# EAGLE design PIZ-Dual v886 (EAGLE 7.6.0)
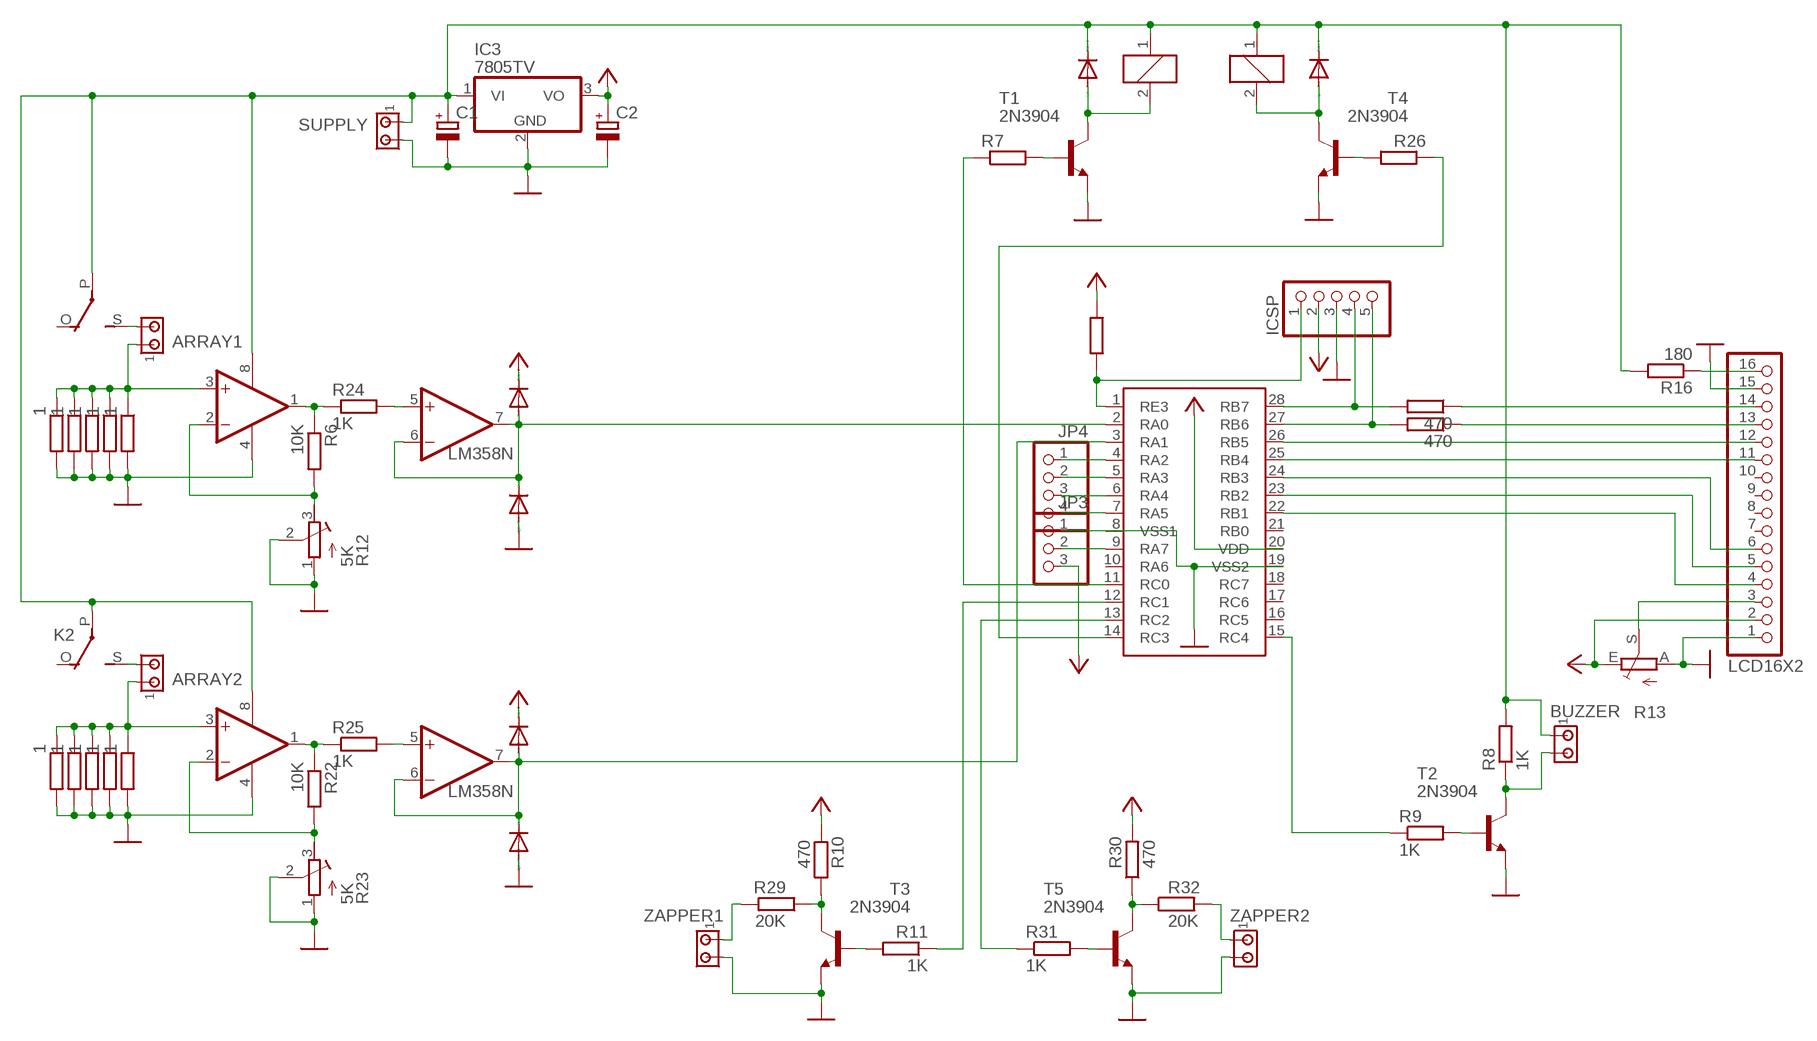
[diagram p0: schematic, sheet 1]

## Parts
ARRAY1  MTA02-100  [10X02MTA]
ARRAY2  MTA02-100  [10X02MTA]
BUZZER  MTA02-100  [10X02MTA]
C1  CPOL-EUE2.5-7  [E2,5-7]
C2  CPOL-EUE2.5-7  [E2,5-7]
D1  1N4148DO35-7  [DO35-7]
D2  1N4148DO35-7  [DO35-7]
D3  1N4148DO35-7  [DO35-7]
D4  1N4148DO35-7  [DO35-7]
D5  1N4148DO35-7  [DO35-7]
D6  1N4148DO35-7  [DO35-7]
IC2  LM358N  [DIL08]
IC3  7805TV  [TO220V]
IC4  LM358N  [DIL08]
ICSP  PINHD-1X55X2MM  [1_05X2MM]
JP3  PINHD-1X3  [1X03]
JP4  PINHD-1X4  [1X04]
K1  G5L  [G5LE]
K2  G5L  [G5LE]
LCD16X2  PINHD-1X16  [1X16]
R1  1  R-EU_0204/7  [0204/7]
R2  1  R-EU_0204/7  [0204/7]
R3  1  R-EU_0204/7  [0204/7]
R4  1  R-EU_0204/7  [0204/7]
R5  1  R-EU_0204/7  [0204/7]
R6  10K  R-EU_0204/7  [0204/7]
R7  R-EU_0204/7  [0204/7]
R8  1K  R-EU_0204/7  [0204/7]
R9  1K  R-EU_0204/7  [0204/7]
R10  470  R-EU_0204/7  [0204/7]
R11  1K  R-EU_0204/7  [0204/7]
R12  5K  R-TRIMM64W  [RTRIM64W]
R13  TRIM_EU-CA6V  [CA6V]
R16  180  R-EU_0309/10  [0309/10]
R17  1  R-EU_0204/7  [0204/7]
R18  1  R-EU_0204/7  [0204/7]
R19  1  R-EU_0204/7  [0204/7]
R20  1  R-EU_0204/7  [0204/7]
R21  1  R-EU_0204/7  [0204/7]
R22  10K  R-EU_0204/7  [0204/7]
R23  5K  R-TRIMM64W  [RTRIM64W]
R24  1K  R-EU_0204/7  [0204/7]
R25  1K  R-EU_0204/7  [0204/7]
R26  R-EU_0204/7  [0204/7]
R27  470  R-EU_0204/7  [0204/7]
R28  470  R-EU_0204/7  [0204/7]
R29  20K  R-EU_0204/7  [0204/7]
R30  470  R-EU_0204/7  [0204/7]
R31  1K  R-EU_0204/7  [0204/7]
R32  20K  R-EU_0204/7  [0204/7]
R33  10K  R-EU_0204/7  [0204/7]
SUPPLY  MTA02-100  [10X02MTA]
T1  2N3904  [TO92]
T2  2N3904  [TO92]
T3  2N3904  [TO92]
T4  2N3904  [TO92]
T5  2N3904  [TO92]
U$1  PIC16F88  [SO28W]
ZAPPER1  MTA02-100  [10X02MTA]
ZAPPER2  MTA02-100  [10X02MTA]

## Nets
E: R11.1 U$1.12(RC1)
GND: C1.- C2.- D2.A D5.A IC2.4(P:V-) IC3.2(GND) IC4.4(P:V-) ICSP.3 JP3.1 LCD16X2.1 LCD16X2.15 R1.2 R2.2 R3.2 R4.2 R5.2 R12.1(A) R12.2(S) R13.A R17.2 R18.2 R19.2 R20.2 R21.2 R23.1(A) R23.2(S) SUPPLY.2 T1.3(E) T2.3(E) T3.3(E) T4.3(E) T5.3(E) U$1.8(VSS1) U$1.19(VSS2) ZAPPER1.2 ZAPPER2.2
N$1: ARRAY1.1 IC2.3(A:+IN) R1.1 R2.1 R3.1 R4.1 R5.1
N$2: ARRAY1.2 K1.S(2:S)
N$3: IC2.1(A:OUT) R6.1 R24.1
N$4: IC2.2(A:-IN) R6.2 R12.3(E)
N$5: BUZZER.2 R8.1 T2.1(C)
N$6: D1.A D2.C IC2.6(B:-IN) IC2.7(B:OUT) U$1.2(RA0)
N$7: D3.A K1.2 T1.1(C)
N$8: R29.2 ZAPPER1.1
N$9: R7.2 T1.2(B)
N$10: R9.2 T2.2(B)
N$11: R11.2 T3.2(B)
N$12: R9.1 U$1.15(RC4)
N$13: LCD16X2.4 U$1.22(RB1)
N$14: R7.1 U$1.11(RC0)
N$15: LCD16X2.14 R27.1
N$16: LCD16X2.13 R28.1
N$17: LCD16X2.12 U$1.26(RB5)
N$18: LCD16X2.11 U$1.25(RB4)
N$19: ARRAY2.1 IC4.3(A:+IN) R17.1 R18.1 R19.1 R20.1 R21.1
N$21: LCD16X2.6 U$1.24(RB3)
N$22: LCD16X2.3 R13.S
N$23: LCD16X2.5 U$1.23(RB2)
N$24: BUZZER.1 C1.+ D3.C D6.C IC2.8(P:V+) IC3.1(VI) IC4.8(P:V+) K1.1 K1.P(2:P) K2.1 K2.P(2:P) R8.2 R16.2 SUPPLY.1
N$25: LCD16X2.16 R16.1
N$26: ICSP.5 R28.2 U$1.27(RB6)
N$27: ICSP.4 R27.2 U$1.28(RB7)
N$28: IC4.1(A:OUT) R22.1 R25.1
N$29: IC4.2(A:-IN) R22.2 R23.3(E)
N$30: D4.A D5.C IC4.6(B:-IN) IC4.7(B:OUT) U$1.3(RA1)
N$31: ARRAY2.2 K2.S(2:S)
N$32: IC2.5(B:+IN) R24.2
N$33: IC4.5(B:+IN) R25.2
N$35: D6.A K2.2 T4.1(C)
N$36: R26.2 T4.2(B)
N$37: R26.1 U$1.14(RC3)
N$38: R31.1 U$1.13(RC2)
N$39: R10.1 R29.1 T3.1(C)
N$40: R31.2 T5.2(B)
N$41: R32.2 ZAPPER2.1
N$42: JP4.1 U$1.4(RA2)
N$43: R30.1 R32.1 T5.1(C)
N$44: ICSP.1 R33.2 U$1.1(RE3)
N$46: JP4.2 U$1.5(RA3)
N$49: JP4.3 U$1.6(RA4)
N$50: JP4.4 U$1.7(RA5)
N$51: JP3.2 U$1.9(RA7)
VCC: C2.+ D1.C D4.C IC3.3(VO) ICSP.2 JP3.3 LCD16X2.2 R10.2 R13.E R30.2 R33.1 U$1.20(VDD)
Unconnected: K1.O(2:O) K2.O(2:O) LCD16X2.7 LCD16X2.8 LCD16X2.9 LCD16X2.10 U$1.10(RA6) U$1.16(RC5) U$1.17(RC6) U$1.18(RC7) U$1.21(RB0)

## Library data of the parts
ARRAY1 ARRAY2 BUZZER SUPPLY ZAPPER1 ZAPPER2 = con-amp:MTA02-100: AMP connector
C1 C2 = rcl:CPOL-EU: POLARIZED CAPACITOR, European symbol
D1-D6 = diode:1N4148: DIODE high speed (Philips)
IC2 IC4 = linear:LM358: OP AMP also LM158; LM258; LM2904 Source: http://cache.national.com/ds/LM/LM158.pdf
IC3 = linear:78*: Positive VOLTAGE REGULATOR Source: http://cache.national.com/ds/LM/LM78L05.pdf http://www.fairchildsemi.com/ds/LM/LM7805.pdf
ICSP = pinhead:PINHD-1X5: PIN HEADER
JP3 = pinhead:PINHD-1X3: PIN HEADER
JP4 = pinhead:PINHD-1X4: PIN HEADER
K1 K2 = relay:G5L: RELAY 1 x switch, 10 A/120 V AC, 8 A/30 V ADC, Omron; OC_FARNELL: unknown; OC_NEWARK: unknown
LCD16X2 = pinhead:PINHD-1X16: PIN HEADER
R1-R11 R16-R22 R24-R33 = rcl:R-EU_: RESISTOR, European symbol
R12 R23 = rcl:R-TRIMM: Trimm resistor
R13 = pot:TRIM_EU-: POTENTIOMETER
T1-T5 = transistor:2N3904: NPN TRANSISTOR
U$1 = microchip:PIC16F88*: PIC16F886 - Hecho por Cesar Gil Lao

## Board
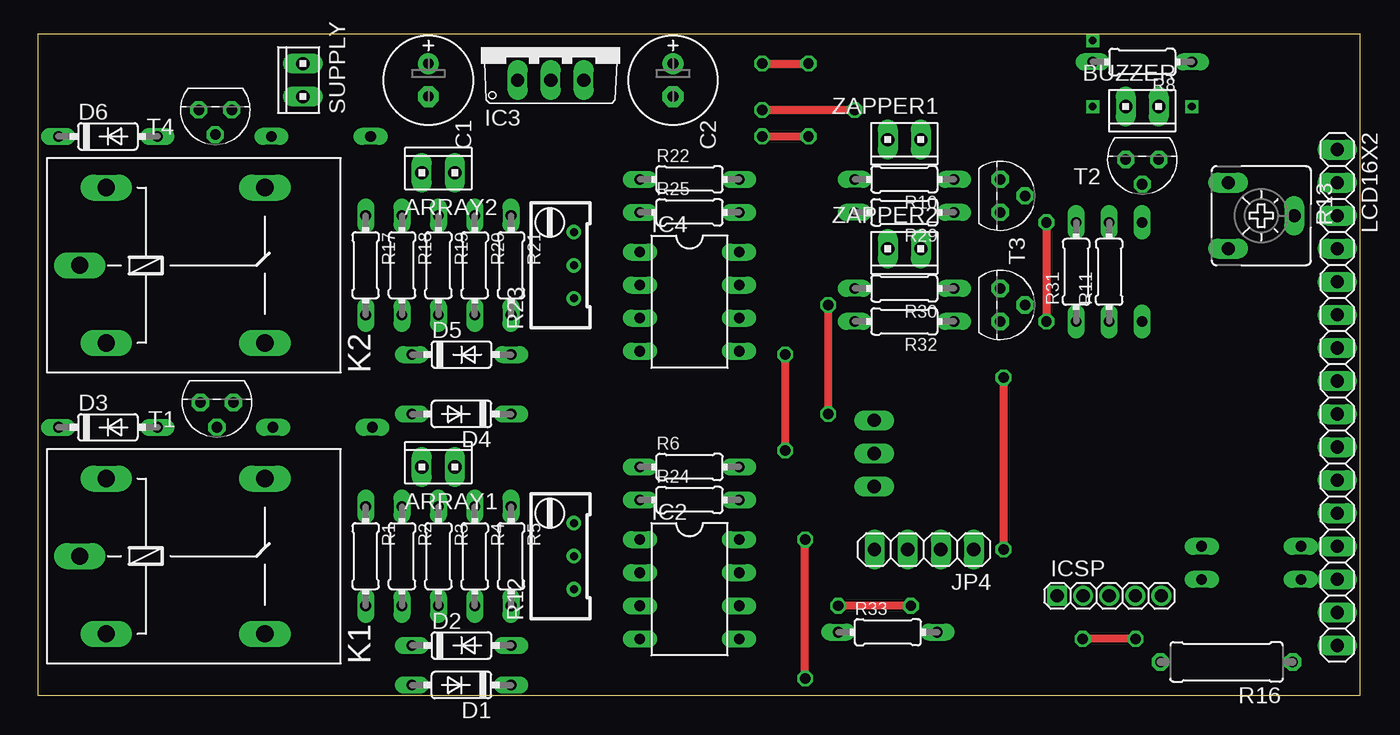
[diagram p1: board, top side]
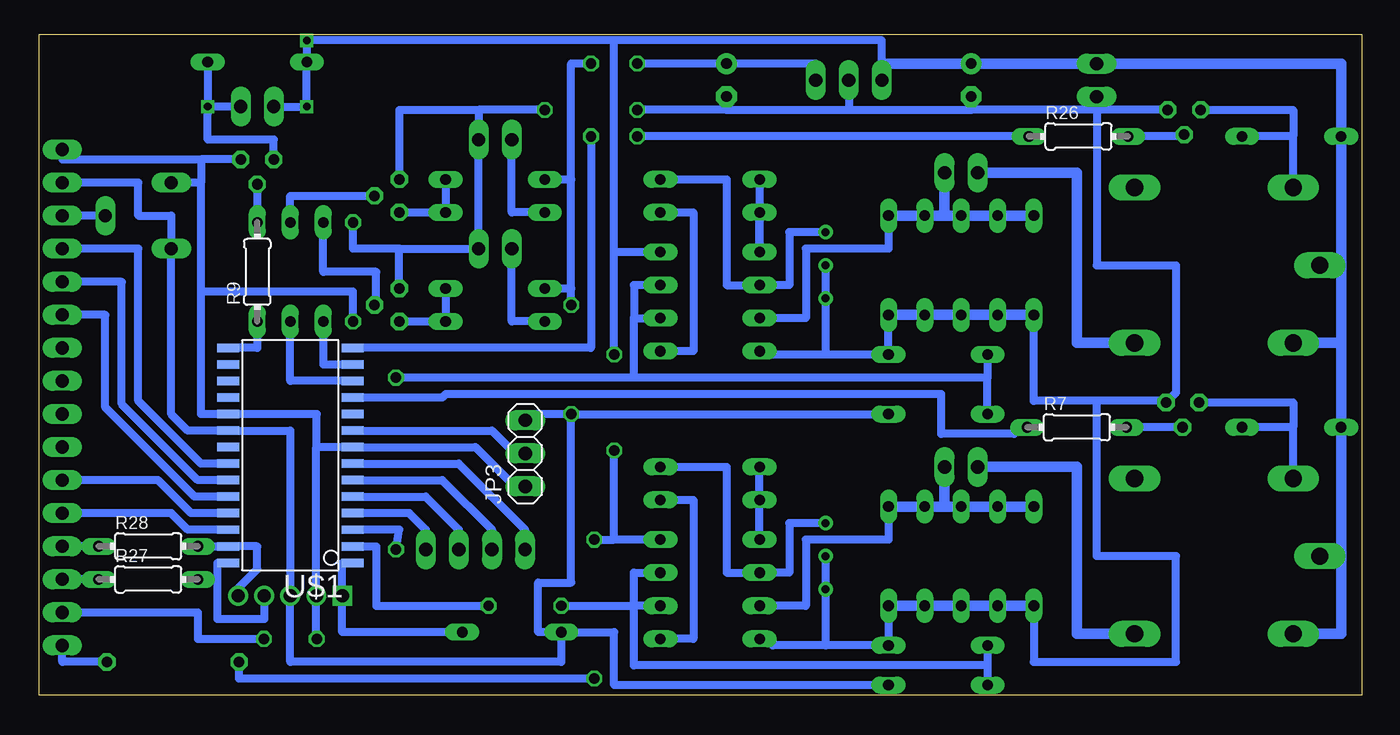
[diagram p2: board, bottom side, seen from below]

Size 101.65 x 50.78 mm. Coordinates in mm from the lower left corner, seen from the top.
Outline: 101.65,0 101.65,50.78 0,50.78 0,0 101.65,0
Copper layers (1*16): Top 0.035mm / dielectric 1.5mm / Bottom 0.035mm
Design rules "default": minimum track width 10mil, minimum drill 24mil, track to track 8mil, track to pad 8mil, pad to pad 8mil, via to via 8mil, smd to smd 8mil, copper to edge 40mil, drill to drill 8mil, minimum pad ring 10mil, minimum via ring 8mil, stop-mask expansion 4mil, vias tented up to drill 0mil, thermal gap 10mil

### Footprints (pad centres in the part's own frame; a part is rotated, then mirrored left to right if it is on the bottom)
10X02MTA = drill 1.016 long: 1 1.27,0; 2 -1.27,0
E2,5-7 = drill 0.813 pad 1.6: + -1.27,0 | drill 0.813 pad 1.6 octagon: - 1.27,0
DO35-7 = drill 0.813 long: A 3.81,0; C -3.81,0
DIL08 = drill 0.813 pad 1.27 long: 1 -3.81,-3.81; 2 -1.27,-3.81; 3 1.27,-3.81; 4 3.81,-3.81; 5 3.81,3.81; 6 1.27,3.81; 7 -1.27,3.81; 8 -3.81,3.81
TO220V = drill 1.016 long: 1 -2.54,-2.54; 2 0,-2.54; 3 2.54,-2.54
1_05X2MM = drill 1.016 pad 1.3 square: 1 -4,0 | drill 1.016 pad 1.3: 2 0,0; 3 -2,0; 4 2,0; 5 4,0
1X03 = drill 1.016 long: 1 -2.54,0; 2 0,0; 3 2.54,0
1X04 = drill 1.016 long: 1 -3.81,0; 2 -1.27,0; 3 1.27,0; 4 3.81,0
G5LE = drill 1.321 long: 1 -7.493,-5.969; 2 -7.493,5.969; O 4.699,5.969; P -9.525,0; S 4.699,-5.969
1X16 = drill 1.016 long: 1 -19.05,0; 2 -16.51,0; 3 -13.97,0; 4 -11.43,0; 5 -8.89,0; 6 -6.35,0; 7 -3.81,0; 8 -1.27,0; 9 1.27,0; 10 3.81,0; 11 6.35,0; 12 8.89,0; 13 11.43,0; 14 13.97,0; 15 16.51,0; 16 19.05,0
0204/7 = drill 0.813 long: 1 -3.81,0; 2 3.81,0
RTRIM64W = drill 0.61: 1 1.27,-2.54; 2 1.27,0; 3 1.27,2.54
CA6V = drill 1.016 long: A -2.54,-2.54; E 2.54,-2.54; S 0,2.54
0309/10 = drill 0.813 octagon: 1 -5.08,0; 2 5.08,0
TO92 = drill 0.813 octagon: 1 1.27,0; 2 0,1.905; 3 -1.27,0
SO28W = smd 0.65 x 1.7: 1 -7.62,-4.78; 2 -6.35,-4.78; 3 -5.08,-4.78; 4 -3.81,-4.78; 5 -2.54,-4.78; 6 -1.27,-4.78; 7 0,-4.78; 8 1.27,-4.78; 9 2.54,-4.78; 10 3.81,-4.78; 11 5.08,-4.78; 12 6.35,-4.78; 13 7.62,-4.78; 14 8.89,-4.78; 15 8.89,4.78; 16 7.62,4.78; 17 6.35,4.78; 18 5.08,4.78; 19 3.81,4.78; 20 2.54,4.78; 21 1.27,4.78; 22 0,4.78; 23 -1.27,4.78; 24 -2.54,4.78; 25 -3.81,4.78; 26 -5.08,4.78; 27 -6.35,4.78; 28 -7.62,4.78

### Placement (x,y rotation side)
ARRAY1  30.79,17.53 0 top
ARRAY2  30.79,40.13 0 top
BUZZER  84.89,45.21 180 top
C1  30.02,47.24 270 top
C2  48.82,47.24 270 top
D1  32.56,0.76 180 top
D2  32.56,3.81 0 top
D3  5.38,20.57 0 top
D4  32.56,21.59 180 top
D5  32.56,26.16 0 top
D6  5.38,42.93 0 top
IC2  50.09,8.13 270 top
IC3  39.42,49.78 0 top
IC4  50.09,30.23 270 top
ICSP  82.35,7.62 0 top
JP3  64.29,18.56 90 bottom
JP4  68.12,11.18 180 top
K1  12.75,10.67 0 top
K2  12.75,33.02 0 top
LCD16X2  99.87,22.86 270 top
R1  25.2,10.67 270 top
R2  27.99,10.67 270 top
R3  30.79,10.67 270 top
R4  33.58,10.67 270 top
R5  36.37,10.67 270 top
R6  50.09,17.53 0 top
R7  21.89,20.57 0 bottom
R8  84.89,48.64 180 top
R9  84.89,32.51 90 bottom
R10  66.6,39.62 180 top
R11  82.35,32.51 90 top
R12  39.93,10.67 0 top
R13  94.03,36.83 270 top
R16  91.36,2.54 180 top
R17  25.2,33.02 270 top
R18  27.99,33.02 270 top
R19  30.79,33.02 270 top
R20  33.58,33.02 270 top
R21  36.37,33.02 270 top
R22  50.09,39.62 0 top
R23  39.93,33.02 0 top
R24  50.09,14.99 0 top
R25  50.09,37.08 0 top
R26  21.77,42.93 0 bottom
R27  93.27,8.89 0 bottom
R28  93.27,11.43 0 bottom
R29  66.6,37.08 180 top
R30  66.6,31.24 180 top
R31  79.81,32.51 90 top
R32  66.6,28.7 180 top
R33  65.33,4.83 0 top
SUPPLY  20.37,47.24 90 top
T1  13.77,22.48 180 top
T2  84.89,41.15 180 top
T3  73.97,38.35 270 top
T4  13.64,44.96 180 top
T5  73.97,29.97 270 top
U$1  82.35,17.78 90 bottom
ZAPPER1  66.6,42.67 180 top
ZAPPER2  66.6,34.29 180 top

### Tracks (layer width: path | path; a pad name or v marks a point on that pad's centre or on a via)
E
  Bottom 0.61: U$1.12 82.35,24.13 R11.1
GND  (via drill 0.8)
  Top 0.61: v55.68,44.96 v62.79,44.96 | v77.52,36.32 v77.52,28.7 | v84.38,4.32 v80.31,4.32
  Bottom 0.61: 20.37,22.61 15.04,22.61 T1.3 14.28,23.24 14.28,33.02 20.37,33.02 20.37,44.96 | 20.37,22.61 25.2,22.61 R17.2 | R1.2 25.2,2.54 14.28,2.54 14.28,10.67 20.37,10.67 20.37,22.61 | 89.2,30.99 89.2,21.59 U$1.19 80.31,21.59 80.31,19.05 | 89.2,30.99 89.2,39.37 | 89.2,39.37 R13.A | 89.2,41.15 89.2,39.37 | T3.3 73.97,44.96 67.87,44.96 | 73.97,34.29 ZAPPER2.2 ZAPPER1.2 67.87,44.96 | T2.3 89.2,41.15 | C2.- 48.82,44.96 | 48.82,44.96 39.42,44.96 | 39.42,44.96 30.02,44.96 | 30.02,44.96 C1.- | IC3.2 39.42,44.96 | 48.82,44.96 v55.68,44.96 | v62.79,44.96 67.87,44.96 | T4.3 20.37,44.96 | 20.37,44.96 30.02,44.96 | SUPPLY.2 20.37,44.96 | IC4.4 46.28,26.16 41.2,26.16 | 41.2,26.16 D5.A R21.2 | R23.2 R23.1 41.2,26.16 | R12.2 R12.1 41.2,3.81 | 41.2,3.81 D2.A R5.2 | 41.2,3.81 45.26,3.81 IC2.4 | JP3.1 64.31,16 65.08,16 68.12,19.05 U$1.8 80.31,19.05 | T5.3 73.97,34.29 | 73.97,34.29 77.52,34.29 v77.52,36.32 | v77.52,28.7 77.52,30.99 89.2,30.99 | 80.31,19.05 80.35,19.05 ICSP.3 80.35,4.32 v80.31,4.32 | LCD16X2.1 99.87,41.15 89.2,41.15 | LCD16X2.15 89.46,6.35 89.46,4.32 v84.38,4.32
  Bottom 0.813: R21.2 R20.2 R19.2 R18.2 R17.2 | R1.2 R2.2 R3.2 R4.2 R5.2
N$1
  Bottom 0.61: R5.1 36.37,11.94 42.72,11.94 42.72,6.86 IC2.3
  Bottom 0.813: R1.1 R2.1 R3.1 32.05,14.48 | 32.05,14.48 R4.1 R5.1 | ARRAY1.1 32.05,14.48
N$2
  Bottom 0.813: K1.S 21.89,4.7 21.89,17.53 ARRAY1.2
N$3
  Bottom 0.61: IC2.1 R24.1 R6.1
N$4
  Bottom 0.61: R12.3 43.99,13.21 43.99,9.4 IC2.2 48.82,9.4 48.82,17.53 R6.2
N$5  (via drill 0.6)
  Bottom 0.61: BUZZER.2 v88.7,45.21 | T2.1 83.62,42.67 88.7,42.67 88.7,44.7 v88.7,45.21 | R8.1 v88.7,45.21
N$6  (via drill 0.8)
  Top 0.61: v67.11,6.86 v61.52,6.86
  Bottom 0.61: 28.75,2.29 D1.A | D2.C 28.75,2.29 | 28.75,2.29 55.93,2.29 55.93,6.86 | 55.93,6.86 55.93,9.4 IC2.7 | IC2.6 55.93,6.86 | U$1.2 75.74,11.43 75.74,6.86 v67.11,6.86 | v61.52,6.86 55.93,6.86
N$7
  Bottom 0.61: K1.2 5.26,20.57 | 5.26,20.57 D3.A | T1.1 5.26,22.48 5.26,20.57
N$8
  Bottom 0.61: R29.2 65.33,37.08 ZAPPER1.1
N$9
  Bottom 0.61: T1.2 R7.2
N$10
  Bottom 0.61: T2.2 R9.2
N$11
  Bottom 0.61: R11.2 82.35,38.35 T3.2
N$12
  Bottom 0.61: R9.1 84.89,26.67 U$1.15
N$13
  Bottom 0.61: U$1.22 89.2,17.78 94.03,22.61 94.03,34.29 LCD16X2.4
N$14
  Bottom 0.61: U$1.11 70.66,22.86 70.41,23.11 32.31,23.11 32.31,20.07 26.72,20.07 26.21,20.57 R7.1
N$15
  Bottom 0.61: R27.1 LCD16X2.14
N$16
  Bottom 0.61: R28.1 LCD16X2.13
N$17
  Bottom 0.61: U$1.26 90.22,12.7 91.49,13.97 LCD16X2.12
N$18
  Bottom 0.61: U$1.25 89.97,13.97 92.51,16.51 LCD16X2.11
N$19
  Bottom 0.61: R21.1 36.37,34.29 42.72,34.29 42.72,28.96 IC4.3
  Bottom 0.813: R21.1 R20.1 32.31,36.83 | 32.31,36.83 R19.1 R18.1 R17.1 | ARRAY2.1 32.05,37.08 32.31,36.83
N$21
  Bottom 0.61: U$1.24 89.71,15.24 96.57,22.1 96.57,29.21 LCD16X2.6
N$22
  Bottom 0.61: R13.S LCD16X2.3
N$23
  Bottom 0.61: U$1.23 89.46,16.51 95.3,22.35 95.3,31.75 LCD16X2.5
N$24  (via drill 0.6, 0.8)
  Top 0.61: v57.46,18.8 v57.46,26.16 | v58.98,1.27 v58.98,11.94
  Bottom 0.61: v58.98,1.27 86.28,1.27 R16.2 | BUZZER.1 v81.08,45.21 R8.2 v81.08,50.29 57.46,50.29 | IC3.1 36.88,50.29 57.46,50.29 | IC4.8 57.46,34.04 | 57.46,34.04 57.46,50.29 | IC2.8 57.46,11.94 | 57.46,11.94 v57.46,18.8 | v57.46,26.16 57.46,34.04 | v58.98,11.94 57.46,11.94
  Bottom 0.813: 1.57,33.02 D6.C 1.57,48.51 SUPPLY.1 C1.+ 36.88,48.51 IC3.1 | 1.57,27.05 D3.C 1.57,10.67 | 1.57,27.05 1.57,33.02 | 1.57,33.02 K2.P | K2.1 1.57,27.05 | K1.1 1.57,4.7 1.57,10.67 | K1.P 1.57,10.67
N$25
  Bottom 0.61: R16.1 99.87,2.54 LCD16X2.16
N$26
  Bottom 0.61: ICSP.5 86.35,8.19 84.89,9.65 84.89,11.43 U$1.27 R28.2
N$27
  Bottom 0.61: ICSP.4 84.35,5.84 87.94,5.84 87.94,8.89 | 87.94,8.89 87.94,10.16 U$1.28 | R27.2 87.94,8.89
N$28
  Bottom 0.61: R25.1 IC4.1 R22.1
N$29
  Bottom 0.61: R23.3 43.99,35.56 43.99,31.5 IC4.2 48.82,31.5 48.82,39.62 R22.2
N$30  (via drill 0.8)
  Top 0.61: v74.22,24.38 v74.22,11.18
  Bottom 0.61: D4.A 28.75,24.38 | D5.C 28.75,24.38 | 28.75,24.38 55.93,24.38 | 55.93,24.38 55.93,28.96 | 55.93,28.96 IC4.6 | IC4.7 55.93,31.5 55.93,28.96 | 55.93,24.38 v74.22,24.38 | v74.22,11.18 73.97,12.7 U$1.3
N$31
  Bottom 0.813: K2.S 21.89,27.05 21.89,40.13 ARRAY2.2
N$32
  Bottom 0.61: R24.2 51.36,14.99 51.36,4.32 IC2.5
N$33
  Bottom 0.61: R25.2 51.36,37.08 51.36,26.42 IC4.5
N$35
  Bottom 0.61: K2.2 5.26,42.93 | 5.26,42.93 D6.A | T4.1 5.26,44.96 5.26,42.93
N$36
  Bottom 0.61: T4.2 13.64,42.93 R26.2
N$37  (via drill 0.8)
  Top 0.61: v55.68,42.93 v59.23,42.93
  Bottom 0.61: R26.1 v55.68,42.93 | v59.23,42.93 59.23,26.67 U$1.14
N$38
  Bottom 0.61: R31.1 79.81,25.4 U$1.13
N$39
  Bottom 0.61: R10.1 R29.1 T3.1
N$40
  Bottom 0.61: T5.2 75.74,29.97 75.74,32.51 79.81,32.51 R31.2
N$41
  Bottom 0.61: R32.2 65.33,28.7 ZAPPER2.1
N$42
  Bottom 0.61: U$1.4 73.2,13.97 71.93,12.7 JP4.1
N$43
  Bottom 0.61: R30.1 R32.1 T5.1
N$44
  Bottom 0.61: U$1.1 78.35,10.16 ICSP.1 78.35,4.83 R33.2
N$46
  Bottom 0.61: U$1.5 71.93,15.24 69.39,12.7 JP4.2
N$49
  Bottom 0.61: U$1.6 70.66,16.51 66.85,12.7 JP4.3
N$50
  Bottom 0.61: U$1.7 69.39,17.78 64.31,12.7 JP4.4
N$51
  Bottom 0.61: U$1.9 66.85,20.32 65.08,18.54 64.31,18.54 JP3.2
VCC  (via drill 0.8)
  Top 0.61: v55.68,48.51 v59.23,48.51 | v60.76,21.59 v60.76,29.97
  Bottom 0.61: LCD16X2.2 94.03,39.37 94.03,36.83 91.49,36.83 R13.E 91.49,21.59 90.22,20.32 U$1.20 82.35,20.32 ICSP.2 82.35,2.54 61.52,2.54 R33.1 | v60.76,21.59 D4.C | R33.1 57.46,4.83 57.46,0.76 D1.C | IC3.3 41.96,48.51 C2.+ v55.68,48.51 | R30.2 60.76,31.24 | 60.76,31.24 60.76,39.62 | R10.2 60.76,39.62 | 60.76,39.62 60.76,48.51 v59.23,48.51 | v60.76,29.97 60.76,31.24 | R33.1 63.3,4.83 63.3,8.64 60.76,8.64 v60.76,21.59 | v60.76,21.59 64.29,21.59 JP3.3